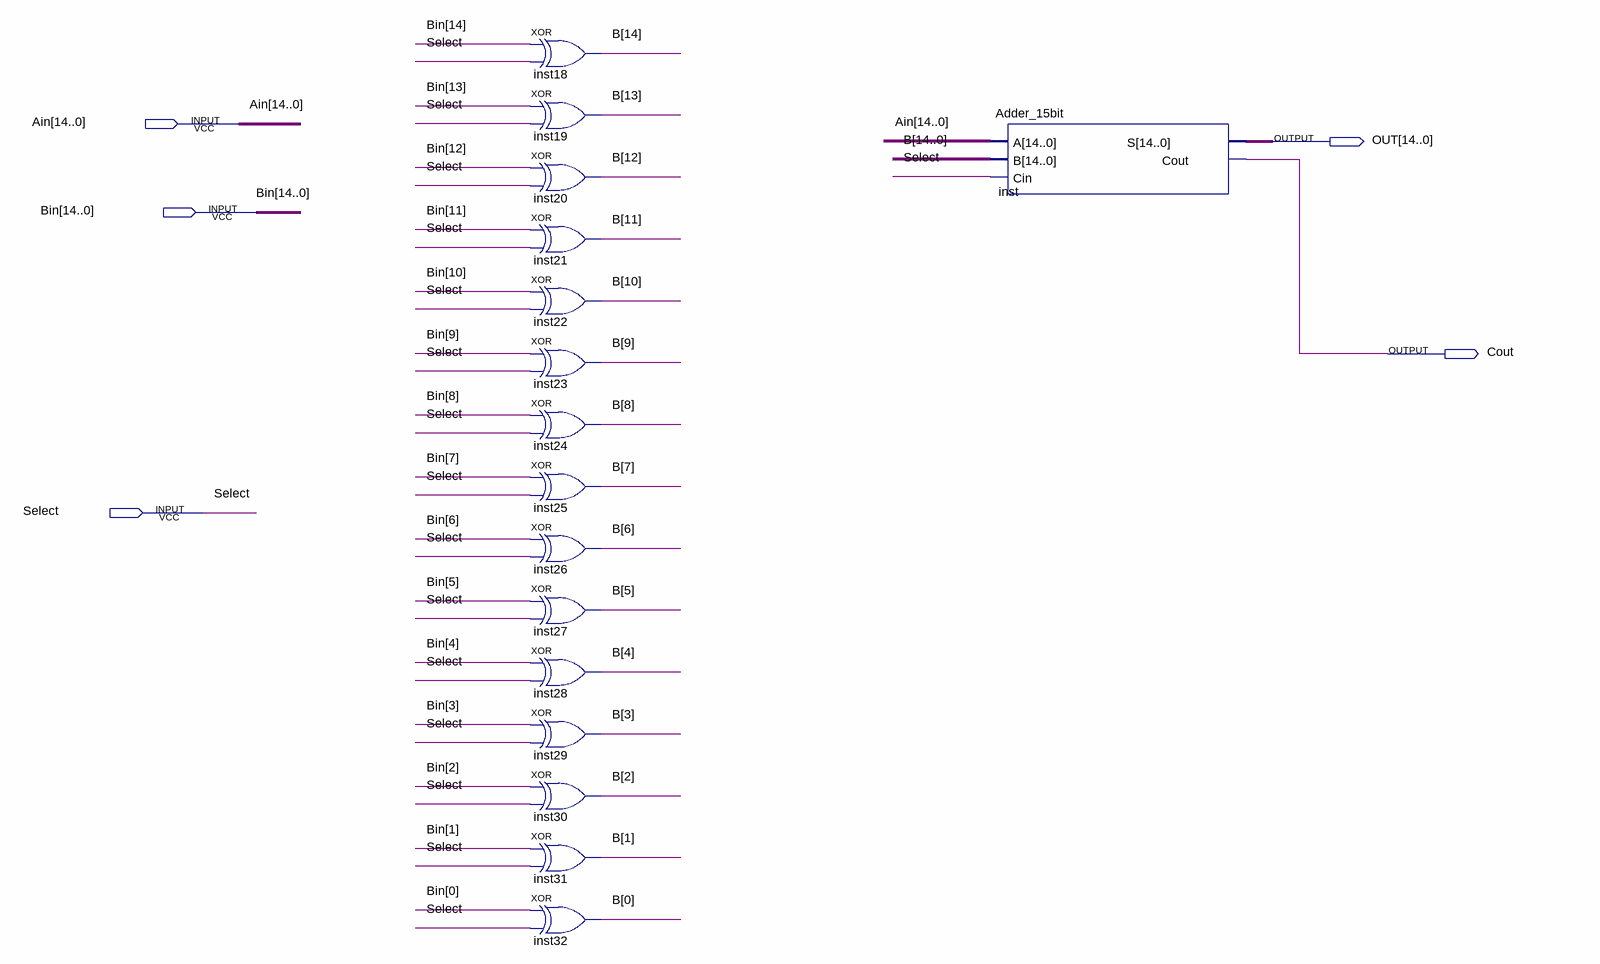
[diagram p0: schematic sheet]
// Quartus schematic AddSub.bdf as structural Verilog: 16 symbols, 5 pins
module AddSub (
  input  [14:0] Ain,
  input  [14:0] Bin,
  input  Select,
  output [14:0] OUT,
  output Cout
);

  wire [14:0] B;

  xor inst18 (B[14], Bin[14], Select);
  xor inst19 (B[13], Bin[13], Select);
  xor inst20 (B[12], Bin[12], Select);
  xor inst21 (B[11], Bin[11], Select);
  xor inst22 (B[10], Bin[10], Select);
  xor inst23 (B[9], Bin[9], Select);
  xor inst24 (B[8], Bin[8], Select);
  xor inst25 (B[7], Bin[7], Select);
  xor inst26 (B[6], Bin[6], Select);
  xor inst27 (B[5], Bin[5], Select);
  xor inst28 (B[4], Bin[4], Select);
  xor inst29 (B[3], Bin[3], Select);
  xor inst30 (B[2], Bin[2], Select);
  xor inst31 (B[1], Bin[1], Select);
  xor inst32 (B[0], Bin[0], Select);
  Adder_15bit inst (.A(Ain), .B(B), .Cin(Select), .S(OUT), .Cout(Cout));
endmodule
